# Altium schematic sheet mainBord_old.SchDoc
size A3
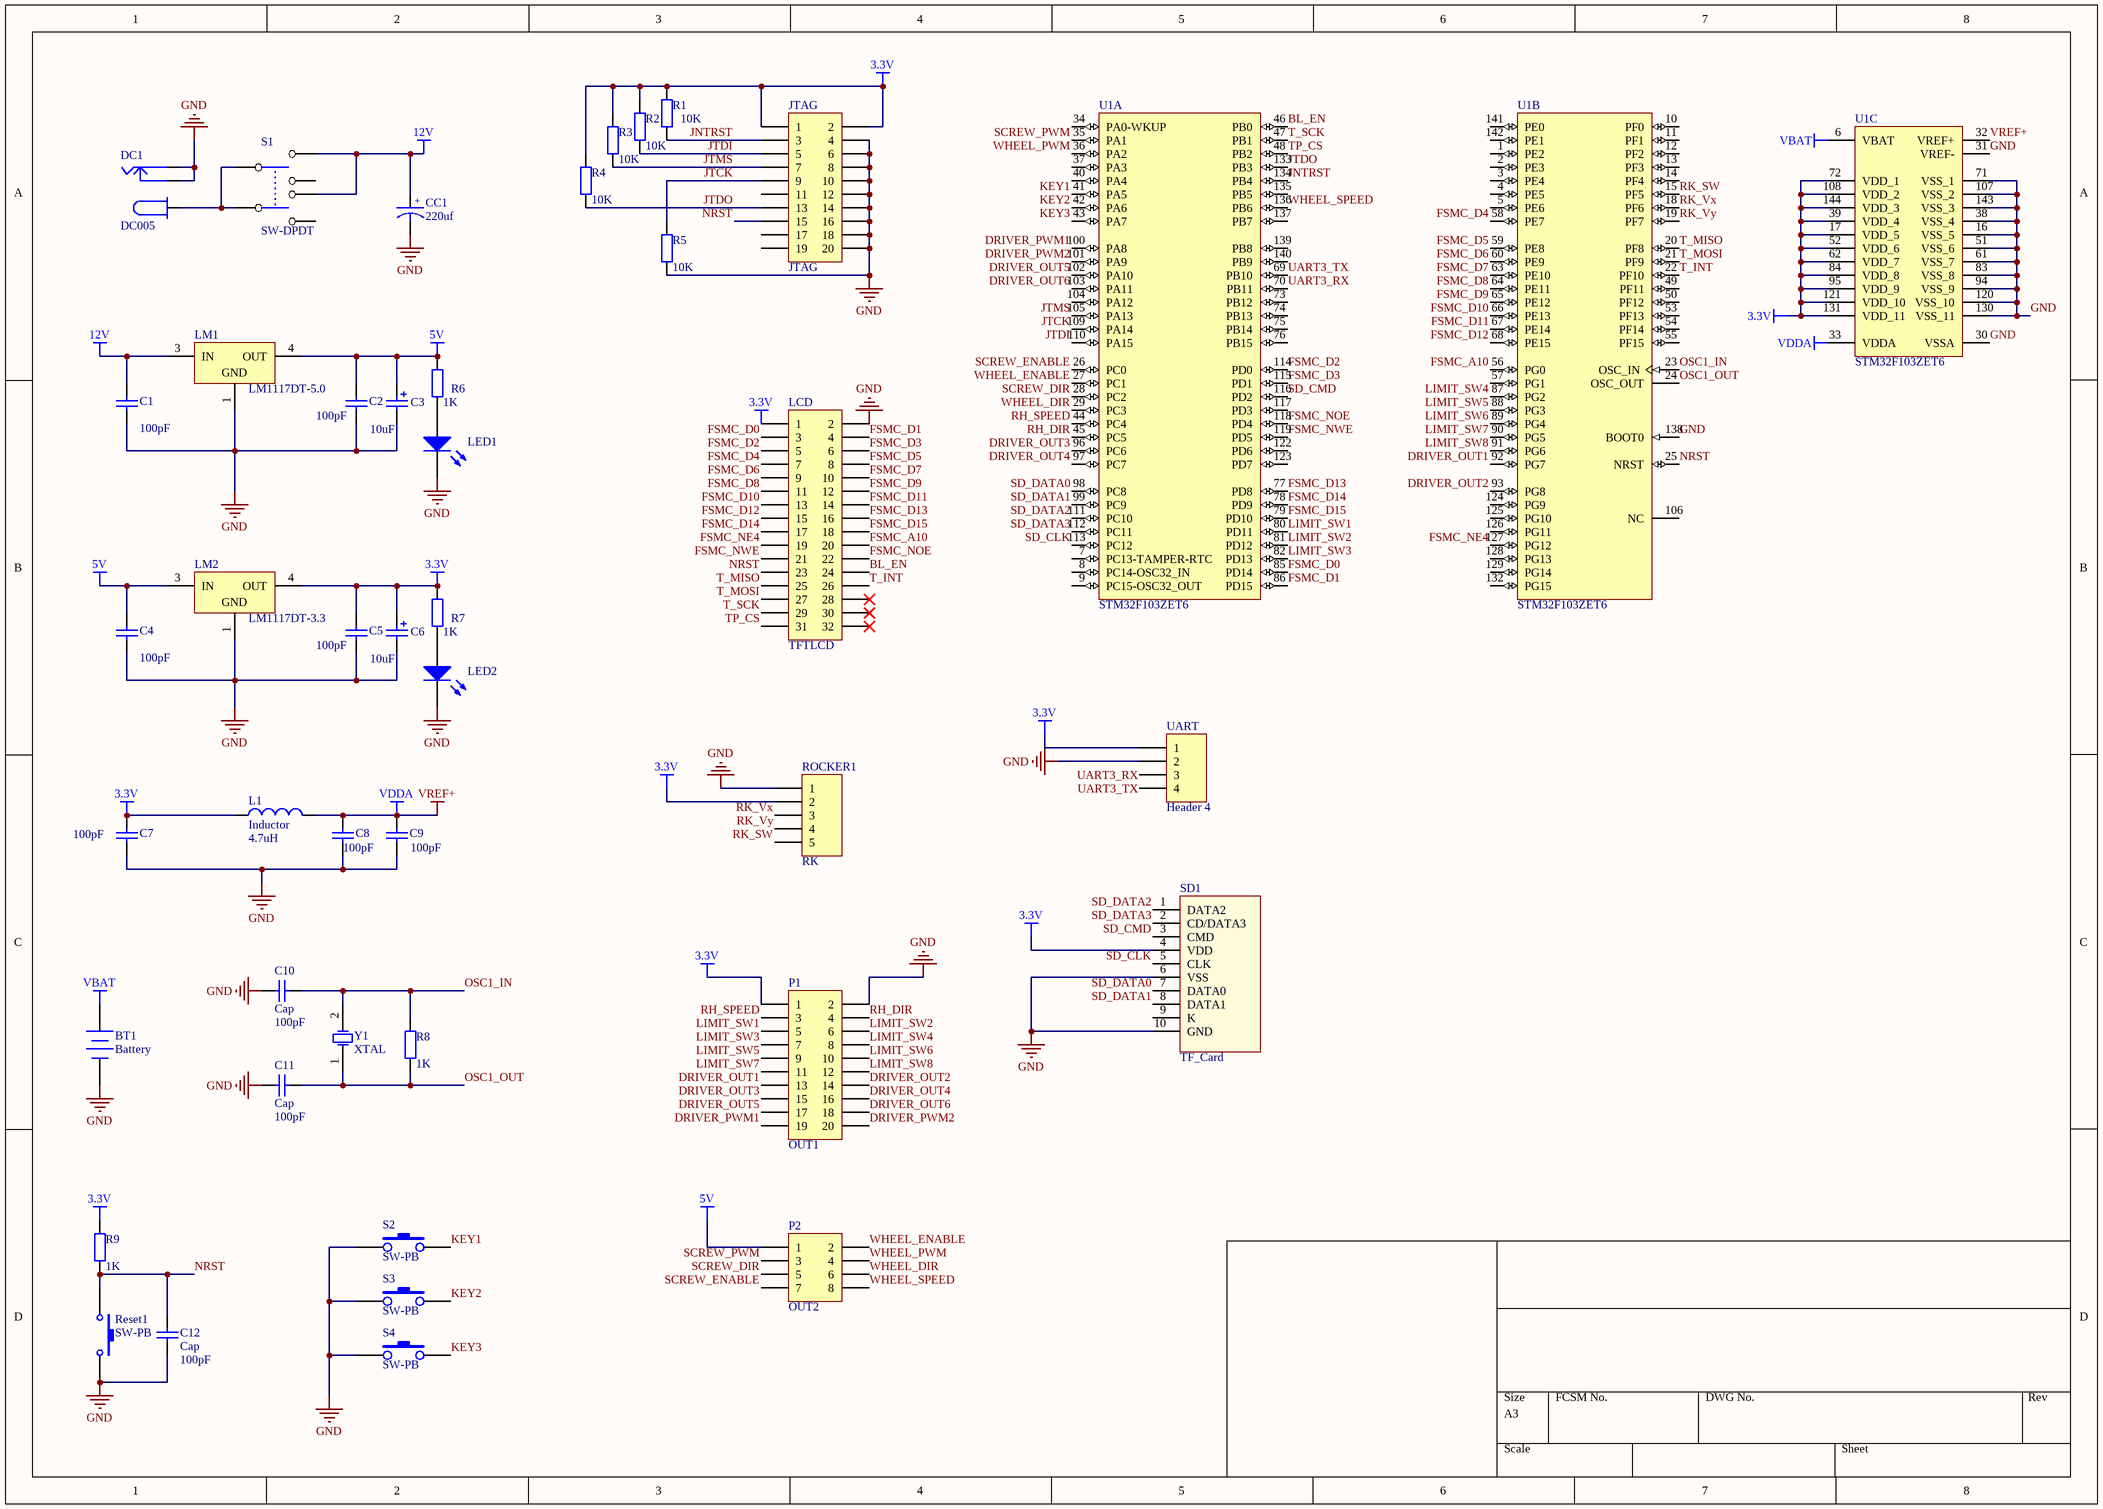
[diagram p0: mainBord_old.SchDoc]

## Parts
BT1  Battery  [battery]
C1  value 100pF  [C 0805_L]  (hidden comment: Cap)
C2  value 100pF  [C 0805_L]  (hidden comment: Cap)
C3  value 10uF  [CD A(3216)]  (hidden comment: Cap Pol2)
C4  value 100pF  [C 0805_L]  (hidden comment: Cap)
C5  value 100pF  [C 0805_L]  (hidden comment: Cap)
C6  value 10uF  [CD A(3216)]  (hidden comment: Cap Pol2)
C7  value 100pF  [C 0805_L]  (hidden comment: Cap)
C8  value 100pF  [C 0805_L]  (hidden comment: Cap)
C9  value 100pF  [C 0805_L]  (hidden comment: Cap)
C10  Cap  value 100pF  [C 0805_L]
C11  Cap  value 100pF  [C 0805_L]
C12  Cap  value 100pF  [C 0805_L]
CC1  220uf  [CC88]
DC1  DC005  [DC005座]
JTAG  JTAG  [JTAG20]
L1  Inductor  value 4.7uH  [L 0805]
LCD  TFTLCD  [HDR2X16]
LED1  LED2  [LED-0805]  (value not drawn)
LED2  LED2  [LED-0805]  (value not drawn)
LM1  LM1117DT-5.0  [SOT-223]
LM2  LM1117DT-3.3  [SOT-223]
P1  OUT1  [JTAG20]
P2  OUT2  [HDR2X4]
R1  value 10K  [R 0805_L]  (hidden comment: Res2)
R2  value 10K  [R 0805_L]
R3  value 10K  [R 0805_L]  (hidden comment: Res2)
R4  value 10K  [R 0805_L]  (hidden comment: Res2)
R5  value 10K  [R 0805_L]  (hidden comment: Res2)
R6  value 1K  [R 0805_L]  (hidden comment: Res2)
R7  value 1K  [R 0805_L]  (hidden comment: Res2)
R8  value 1K  [R 0805_L]  (hidden comment: Res2)
R9  value 1K  [R 0805_L]  (hidden comment: Res2)
Reset1  SW-PB  [微动开关-1]
ROCKER1  RK  [HDR2.54-M-LI-5P]
S1  SW-DPDT  [按键开关-1]
S2  SW-PB  [微动开关-大-1-绿]
S3  SW-PB  [微动开关-大-1-绿]
S4  SW-PB  [微动开关-大-1-绿]
SD1  TF_Card  [Micro SD]
U1  STM32F103ZET6  [STM-LQFP144_N]  (parts A,B,C of 3)
UART  Header 4  [HDR2.54-LI-4P]
Y1  XTAL  [HC-49S]

## Nets
3.3V: C5.2 C6.1 C7.2 JTAG.1 JTAG.2 L1.1 LCD.1 LM2.4(OUT) P1.1 R1.2 R2.2 R3.2 R4.2 R7.2 R9.2 ROCKER1.2 SD1.4(VDD) U1.17(VDD_5) U1.39(VDD_4) U1.52(VDD_6) U1.62(VDD_7) U1.72(VDD_1) U1.84(VDD_8) U1.95(VDD_9) U1.108(VDD_2) U1.121(VDD_10) U1.131(VDD_11) U1.144(VDD_3) UART.1
5V: C2.2 C3.1 C4.2 LM1.4(OUT) LM2.3(IN) P2.1 R6.2
12V: C1.2 CC1.1 LM1.3(IN) S1.2 S1.5
GND: BT1.2(-) C1.1 C2.1 C3.2 C4.1 C5.1 C6.2 C7.1 C8.1 C9.1 C10.2 C11.2 C12.2 CC1.2 DC1.CON(SW) DC1.GND JTAG.4 JTAG.6 JTAG.8 JTAG.10 JTAG.12 JTAG.14 JTAG.16 JTAG.18 JTAG.20 LCD.2 LED1.2(K) LED2.2(K) LM1.1(GND) LM2.1(GND) P1.2 R5.1 Reset1.2 ROCKER1.1 S2.1 S3.1 S4.1 SD1.6(VSS) SD1.10(GND) U1.16(VSS_5) U1.30(VSSA) U1.31(VREF-) U1.38(VSS_4) U1.51(VSS_6) U1.61(VSS_7) U1.71(VSS_1) U1.83(VSS_8) U1.94(VSS_9) U1.107(VSS_2) U1.120(VSS_10) U1.130(VSS_11) U1.138(BOOT0) U1.143(VSS_3) UART.2
VBAT: BT1.1(+) U1.6(VBAT)
VREF+: C8.2 C9.2 L1.2 U1.32(VREF+) U1.33(VDDA)  [also labelled VDDA]
BL_EN: LCD.24 U1.46(PB0)
DRIVER_OUT1: P1.13 U1.92(PG7)
DRIVER_OUT2: P1.14 U1.93(PG8)
DRIVER_OUT3: P1.15 U1.96(PC6)
DRIVER_OUT4: P1.16 U1.97(PC7)
DRIVER_OUT5: P1.17 U1.102(PA10)
DRIVER_OUT6: P1.18 U1.103(PA11)
DRIVER_PWM1: P1.19 U1.100(PA8)
DRIVER_PWM2: P1.20 U1.101(PA9)
FSMC_A10: LCD.20 U1.56(PG0)
FSMC_D0: LCD.3 U1.85(PD14)
FSMC_D1: LCD.4 U1.86(PD15)
FSMC_D2: LCD.5 U1.114(PD0)
FSMC_D3: LCD.6 U1.115(PD1)
FSMC_D4: LCD.7 U1.58(PE7)
FSMC_D5: LCD.8 U1.59(PE8)
FSMC_D6: LCD.9 U1.60(PE9)
FSMC_D7: LCD.10 U1.63(PE10)
FSMC_D8: LCD.11 U1.64(PE11)
FSMC_D9: LCD.12 U1.65(PE12)
FSMC_D10: LCD.13 U1.66(PE13)
FSMC_D11: LCD.14 U1.67(PE14)
FSMC_D12: LCD.15 U1.68(PE15)
FSMC_D13: LCD.16 U1.77(PD8)
FSMC_D14: LCD.17 U1.78(PD9)
FSMC_D15: LCD.18 U1.79(PD10)
FSMC_NE4: LCD.19 U1.127(PG12)
FSMC_NOE: LCD.22 U1.118(PD4)
FSMC_NWE: LCD.21 U1.119(PD5)
JNTRST: JTAG.3 R1.1 U1.134(PB4)
JTCK: JTAG.9 R5.2 U1.109(PA14)
JTDI: JTAG.5 R2.1 U1.110(PA15)
JTDO: JTAG.13 R4.1 U1.133(PB3)
JTMS: JTAG.7 R3.1 U1.105(PA13)
KEY1: S2.2 U1.41(PA5)
KEY2: S3.2 U1.42(PA6)
KEY3: S4.2 U1.43(PA7)
LIMIT_SW1: P1.5 U1.80(PD11)
LIMIT_SW2: P1.6 U1.81(PD12)
LIMIT_SW3: P1.7 U1.82(PD13)
LIMIT_SW4: P1.8 U1.87(PG2)
LIMIT_SW5: P1.9 U1.88(PG3)
LIMIT_SW6: P1.10 U1.89(PG4)
LIMIT_SW7: P1.11 U1.90(PG5)
LIMIT_SW8: P1.12 U1.91(PG6)
NRST: C12.1 JTAG.15 LCD.23 R9.1 Reset1.1 U1.25(NRST)
OSC1_IN: C10.1 R8.2 U1.23(OSC_IN) Y1.2(OSC2)
OSC1_OUT: C11.1 R8.1 U1.24(OSC_OUT) Y1.1(OSC1)
RH_DIR: P1.4 U1.45(PC5)
RH_SPEED: P1.3 U1.44(PC4)
RK_SW: ROCKER1.5 U1.15(PF5)
RK_Vx: ROCKER1.3 U1.18(PF6)
RK_Vy: ROCKER1.4 U1.19(PF7)
SCREW_DIR: P2.5 U1.28(PC2)
SCREW_ENABLE: P2.7 U1.26(PC0)
SCREW_PWM: P2.3 U1.35(PA1)
SD_CLK: SD1.5(CLK) U1.113(PC12)
SD_CMD: SD1.3(CMD) U1.116(PD2)
SD_DATA0: SD1.7(DATA0) U1.98(PC8)
SD_DATA1: SD1.8(DATA1) U1.99(PC9)
SD_DATA2: SD1.1(DATA2) U1.111(PC10)
SD_DATA3: SD1.2(CD/DATA3) U1.112(PC11)
T_INT: LCD.26 U1.22(PF10)
T_MISO: LCD.25 U1.20(PF8)
T_MOSI: LCD.27 U1.21(PF9)
T_SCK: LCD.29 U1.47(PB1)
TP_CS: LCD.31 U1.48(PB2)
UART3_RX: U1.70(PB11) UART.3
UART3_TX: U1.69(PB10) UART.4
WHEEL_DIR: P2.6 U1.29(PC3)
WHEEL_ENABLE: P2.2 U1.27(PC1)
WHEEL_PWM: P2.4 U1.36(PA2)
WHEEL_SPEED: P2.8 U1.136(PB6)
NetDC1_VCC: DC1.VCC S1.1 S1.4
NetLED1_1: LED1.1(A) R6.1
NetLED2_1: LED2.1(A) R7.1

Not connected (* = marked no-connect by the designer): JTAG 11 17 19; LCD 28* 30* 32*; S1 3 6; SD1 9(K); U1 1(PE2) 2(PE3) 3(PE4) 4(PE5) 5(PE6) 7(PC13-TAMPER-RTC) 8(PC14-OSC32_IN) 9(PC15-OSC32_OUT) 10(PF0) 11(PF1) 12(PF2) 13(PF3) 14(PF4) 34(PA0-WKUP) 37(PA3) 40(PA4) 49(PF11) 50(PF12) 53(PF13) 54(PF14) 55(PF15) 57(PG1) 73(PB12) 74(PB13) 75(PB14) 76(PB15) 104(PA12) 106(NC) 117(PD3) 122(PD6) 123(PD7) 124(PG9) 125(PG10) 126(PG11) 128(PG13) 129(PG14) 132(PG15) 135(PB5) 137(PB7) 139(PB8) 140(PB9) 141(PE0) 142(PE1)

## Notes on the sheet
- (in symbol CAP-T) +

## Library data of the parts
BT1 = Battery: Multicell Battery; pin to pad: 1>VBAT 2>GBAT; Published: 24-Mar-1999; LatestRevisionDate: 17-Jul-2002; LatestRevisionNote: Re-released for DXP Platform.; PackageReference: BAT-2; Publisher: Altium Limited; PackageDescription: Battery; 2 Leads
C1 C2 C4 C5 C7-C12 = Cap: Capacitor; pin to pad: 1>2 2>1; Published: 8-Jun-2000; LatestRevisionDate: 17-Jul-2002; LatestRevisionNote: Re-released for DXP Platform.; PackageReference: RAD-0.3; Publisher: Altium Limited; PackageDescription: Radial Cap, Thru-Hole; 2 Leads; 0.3 in Pin Spacing
C3 C6 = Cap Pol2: Polarized Capacitor (Axial); Published: 8-Jun-2000; LatestRevisionDate: 17-Jul-2002; LatestRevisionNote: Re-released for DXP Platform.; PackageReference: POLAR0.8; Publisher: Altium Limited; PackageDescription: Polarized Capacitor; 2 Leads
CC1 = CAP-T: 钽电容
JTAG P1 = Header 10X2: Header, 10-Pin, Dual row; LatestRevisionDate: 17-Jul-2002; LatestRevisionNote: Re-released for DXP Platform.; Publisher: Altium Limited
L1 = Inductor: Code_IEC: 1005; Published: 8-Jun-2000; LatestRevisionDate: 29-May-2009; LatestRevisionNote: IPC-7351 Footprint Added.; PackageReference: 0402-A; Publisher: Altium Limited; PackageDescription: Chip Inductor; Code_JEITA: 0402
LCD = MHDR2X16: Header, 16-Pin, Dual row; LatestRevisionDate: 17-Jul-2002; LatestRevisionNote: Re-released for DXP Platform.; Publisher: Altium Limited
LED1 LED2 = LED2: Typical RED, GREEN, YELLOW, AMBER GaAs LED; Published: 8-Jun-2000; LatestRevisionDate: 17-Jul-2002; LatestRevisionNote: Re-released for DXP Platform.; PackageVersion: Feb-2002; PackageReference: 3.2X1.6X1.1; Publisher: Altium Limited; PackageDescription: SM LED; 2 Flat Leads
LM1 = LM1117DT-5.0: 800mA Low-Dropout Linear Regulator, 3-pin TO-252; Manufacturer: National Semiconductor; PackageTopMarking: NSUZXYTT*LM1117*DT-5.0; PowerWise: N; CompType: LDO IC; High-Reliability: Y; DatasheetVersion: Apr-2006; PackageVersion: revD, Feb-2009; PackageReference: TD03B; PackageDescription: TO252, Molded, Jedec, 6.8 x 6.10 x 2.30mm Body, 3 Lead, 2.28mm Pitch, Surface Mount; PartNumber: LM1117DT-5.0; RoHS: N; PinCount: 3; Code_JEDEC: TO-252-AA; ComponentLink1Description: Manufacturer URL; ComponentLink1URL: http://www.national.com/; ComponentLink2Description: LM1117 Datasheet; ComponentLink2URL: http://www.national.com/ds/LM/LM1117.pdf; ComponentLink3Description: LM1117 Web Page; ComponentLink3URL: http://www.national.com/pf/LM/LM1117.html; ComponentLink4Description: TD03B Package Page; ComponentLink4URL: http://www.national.com/packaging/folders/td03b.html
LM2 = LM1117DT-3.3: 800mA Low-Dropout Linear Regulator, 3-pin TO-252; Manufacturer: National Semiconductor; PackageTopMarking: NSUZXYTT*LM1117*DT-3.3; PowerWise: N; CompType: LDO IC; High-Reliability: Y; DatasheetVersion: Apr-2006; PackageVersion: revD, Feb-2009; PackageReference: TD03B; PackageDescription: TO252, Molded, Jedec, 6.8 x 6.10 x 2.30mm Body, 3 Lead, 2.28mm Pitch, Surface Mount; PartNumber: LM1117DT-3.3; RoHS: N; PinCount: 3; Code_JEDEC: TO-252-AA; ComponentLink1Description: Manufacturer URL; ComponentLink1URL: http://www.national.com/; ComponentLink2Description: LM1117 Datasheet; ComponentLink2URL: http://www.national.com/ds/LM/LM1117.pdf; ComponentLink3Description: LM1117 Web Page; ComponentLink3URL: http://www.national.com/pf/LM/LM1117.html; ComponentLink4Description: TD03B Package Page; ComponentLink4URL: http://www.national.com/packaging/folders/td03b.html
P2 = Header 4X2: Header, 4-Pin, Dual row; LatestRevisionDate: 17-Jul-2002; LatestRevisionNote: Re-released for DXP Platform.; Publisher: Altium Limited
R1-R9 = Res2: Resistor; Published: 8-Jun-2000; LatestRevisionDate: 17-Jul-2002; LatestRevisionNote: Re-released for DXP Platform.; PackageReference: AXIAL-0.4; Publisher: Altium Limited; PackageDescription: Axial Device, Thru-Hole; 2 Leads; 0.4 in Pin Spacing
Reset1 = SW-PB: Switch; Published: 24-Mar-1999; LatestRevisionDate: 17-Jul-2002; LatestRevisionNote: Re-released for DXP Platform.; PackageReference: SPST-2; Publisher: Altium Limited; PackageDescription: Switch; 2 Leads
ROCKER1 = MHDR1X5: Header, 5-Pin; LatestRevisionDate: 17-Jul-2002; LatestRevisionNote: Re-released for DXP Platform.; Publisher: Altium Limited
S2-S4 = 微动开关: pin to pad: 2>3
SD1 = TF_Card: TF卡座; 版权归属: 源创客; BOM名称: TF卡座; 学习资源: www.ooocke.com
U1 = STM32F103ZET6: ARM Cortex-M3 32-bit MCU, 512 KB Flash, 64 KB Internal RAM, 112 I/Os, 144-pin LQFP, -40 to 85 degC, Tray; A/D Converter: 3x12-bit (21 Channel); D/A Converter: 2x12-bit (2 Channel); FLASH Size (Prog) (kB): 512; I/Os (High Current): 112; Internal RAM Size (kB): 64; Operating Frequency(F) (Processor speed) (MHz): 72; Supply Voltage(Vcc) min (V): 2; DatasheetVersion: Rev. 8; PackageVersion: Rev. 4, 06/2013; PackageReference: LQFP144; PackageDescription: 144-Pin Low Profile Quad Flat Package, 20 x 20 mm Body, 0.5 mm Pitch; Supplier 1: Digi-Key; Supplier Part Number 1: 497-6442-ND; Supplier 2: Farnell; Supplier Part Number 2: 1624145; Supplier 3: Newark; Supplier Part Number 3: 57P1270; Supplier 4: Mouser; Supplier Part Number 4: 511-STM32F103ZET6; Core: ARM Cortex-M3; Packing: Tray; Mounting Technology: Surface Mount; PartNumber: STM32F103ZET6; ComponentLink1Description: Manufacturer URL; ComponentLink1URL: http://www.st.com/web/en/home.html; ComponentLink2Description: Datasheet; ComponentLink2URL: http://www.st.com/st-web-ui/static/active/en/resource/technical/document/datasheet/CD00191185.pdf; ComponentLink3Description: Package Specification; ComponentLink3URL: http://www.st.com/st-web-ui/static/active/en/resource/technical/document/datasheet/DM00037051.pdf
UART = Header 4: Header, 4-Pin; LatestRevisionDate: 17-Jul-2002; LatestRevisionNote: Re-released for DXP Platform.; Publisher: Altium Limited
Y1 = XTAL: Crystal Oscillator; pin to pad: 1>XTAL_1 2>XTAL_2; Published: 8-Jun-2000; LatestRevisionDate: 17-Jul-2002; LatestRevisionNote: Re-released for DXP Platform.; PackageReference: R38; Publisher: Altium Limited; PackageDescription: Crystal, Thru-Hole; 2 Leads; Body 3.1 x 8.2 mm (Dia.xH)